# Altium schematic sheet Main.SchDoc: GUAU
size A4; Date: *******; ApprovedBy: *******; CheckedBy: Alberte Gil; Author: *******; CompanyName: *******; DrawnBy: Mario de Miguel; Engineer: *******; Organization: *******; Address1: *******; Address2: *******; Address3: *******; Address4: *******; DocumentNumber: 1; Revision: *******; SheetNumber: 1; SheetTotal: 5; CurrentTime: *******; CurrentDate: *******; Time: *******; DocumentFullPathAndName: *******; DocumentName: *******; ModifiedDate: *******; ImagePath: *******; ProjectName: *******; Application_BuildNumber: *******
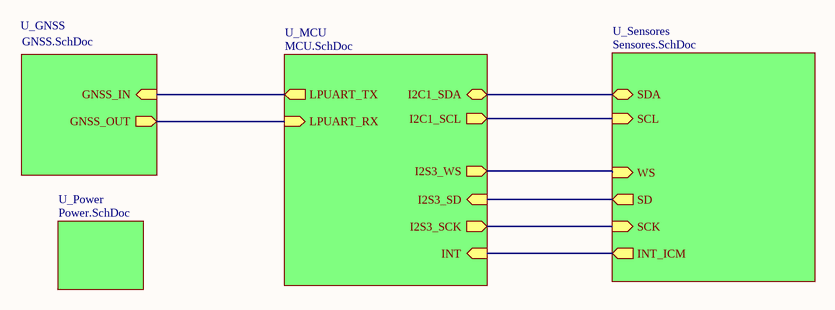
[diagram p0: Main.SchDoc]

## Sub-sheets
U_GNSS = GNSS.SchDoc: GNSS_IN (in), GNSS_OUT (out)
U_MCU = MCU.SchDoc: LPUART_RX (in), LPUART_TX (out), I2C1_SDA (bidir), I2C1_SCL (out), I2S3_WS (out), I2S3_SD (in), I2S3_SCK (out), INT (in)
U_Power = Power.SchDoc: no entries
U_Sensores = Sensores.SchDoc: SDA (bidir), SCL (in), SCK (in), SD (out), INT_ICM (out), WS (in)

## Nets
(unnamed): sheet U_MCU/LPUART_RX, sheet U_GNSS/GNSS_OUT
(unnamed): sheet U_MCU/LPUART_TX, sheet U_GNSS/GNSS_IN
(unnamed): sheet U_MCU/I2C1_SDA, sheet U_Sensores/SDA
(unnamed): sheet U_MCU/I2C1_SCL, sheet U_Sensores/SCL
(unnamed): sheet U_MCU/I2S3_WS, sheet U_Sensores/WS
(unnamed): sheet U_MCU/I2S3_SD, sheet U_Sensores/SD
(unnamed): sheet U_MCU/I2S3_SCK, sheet U_Sensores/SCK
(unnamed): sheet U_MCU/INT, sheet U_Sensores/INT_ICM

## Notes on the sheet
- Title:
- Drawn By:
- Page Contents:
- Checked By:
- Size:
- Date:
- File:
- License:
- Email:
- A4
- Number:
- Time:
- Revision:
- Sheet
- Website:
- of